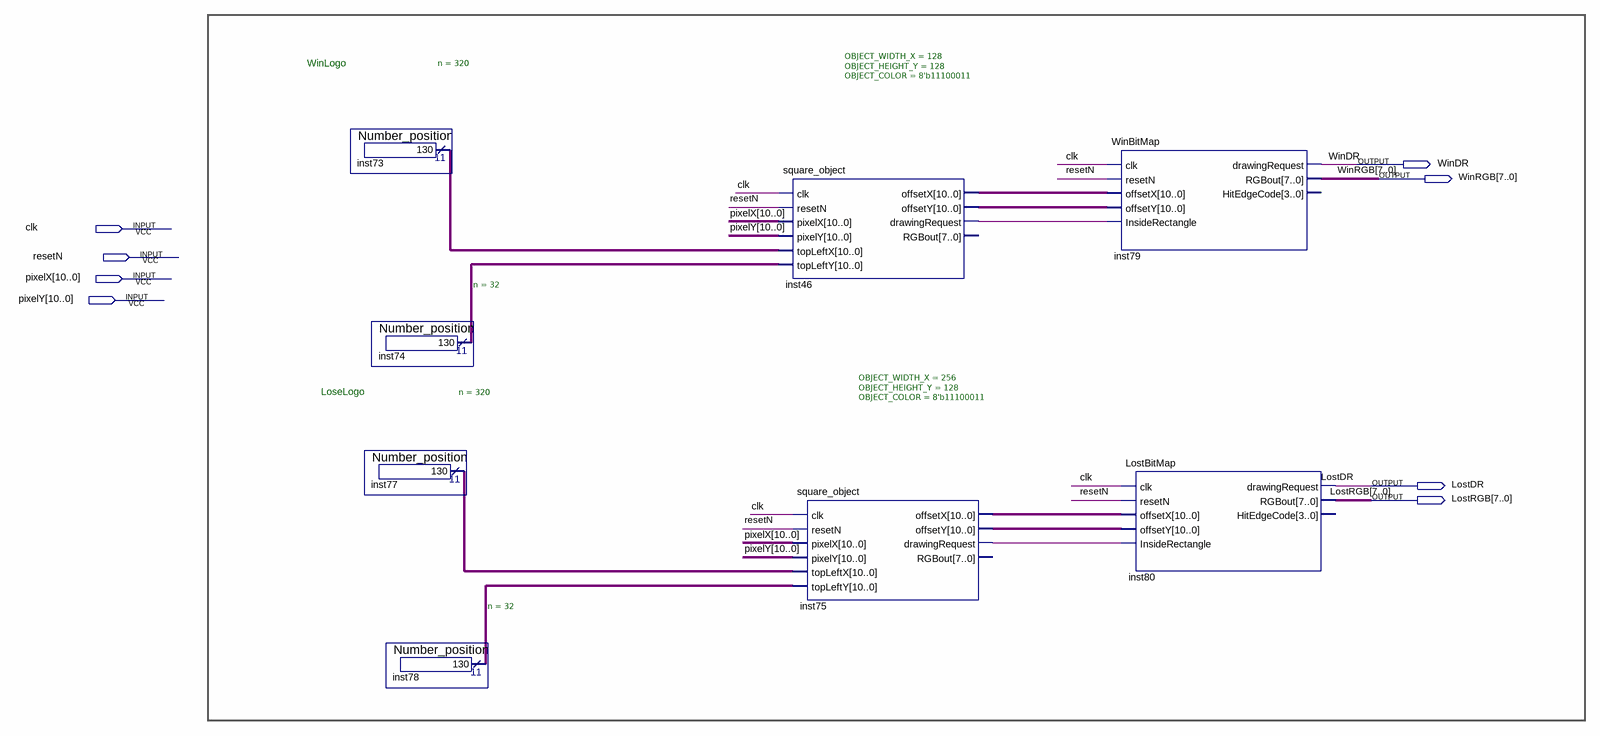
[diagram p0: schematic sheet]
// Quartus schematic Logos_Block.bdf as structural Verilog: 8 symbols, 8 pins
module Logos_Block (
  input  clk,
  input  resetN,
  input  [10:0] pixelX,
  input  [10:0] pixelY,
  output WinDR,
  output [7:0] WinRGB,
  output LostDR,
  output [7:0] LostRGB
);

  wire inst46_drawingrequest, inst75_drawingrequest;
  wire [10:0] inst46_offsetx, inst46_offsety, inst73_result, inst74_result, inst75_offsetx, inst75_offsety,
       inst77_result, inst78_result;

  Number_position #(.n(320)) inst73 (.result(inst73_result));
  Number_position #(.n(32)) inst74 (.result(inst74_result));
  Number_position #(.n(320)) inst77 (.result(inst77_result));
  Number_position #(.n(32)) inst78 (.result(inst78_result));
  square_object #(.OBJECT_WIDTH_X(128), .OBJECT_HEIGHT_Y(128), .OBJECT_COLOR(8'b11100011)) inst46 (
    .clk(clk), .resetN(resetN), .pixelX(pixelX), .pixelY(pixelY), .topLeftX(inst73_result),
    .topLeftY(inst74_result), .offsetX(inst46_offsetx), .offsetY(inst46_offsety),
    .drawingRequest(inst46_drawingrequest));  // open: RGBout
  square_object #(.OBJECT_WIDTH_X(256), .OBJECT_HEIGHT_Y(128), .OBJECT_COLOR(8'b11100011)) inst75 (
    .clk(clk), .resetN(resetN), .pixelX(pixelX), .pixelY(pixelY), .topLeftX(inst77_result),
    .topLeftY(inst78_result), .offsetX(inst75_offsetx), .offsetY(inst75_offsety),
    .drawingRequest(inst75_drawingrequest));  // open: RGBout
  WinBitMap inst79 (
    .clk(clk), .resetN(resetN), .offsetX(inst46_offsetx), .offsetY(inst46_offsety),
    .InsideRectangle(inst46_drawingrequest), .drawingRequest(WinDR), .RGBout(WinRGB));  // open: HitEdgeCode
  LostBitMap inst80 (
    .clk(clk), .resetN(resetN), .offsetX(inst75_offsetx), .offsetY(inst75_offsety),
    .InsideRectangle(inst75_drawingrequest), .drawingRequest(LostDR), .RGBout(LostRGB));  // open: HitEdgeCode

  // Notes on the sheet:
  //   WinLogo
  //   LoseLogo
endmodule
